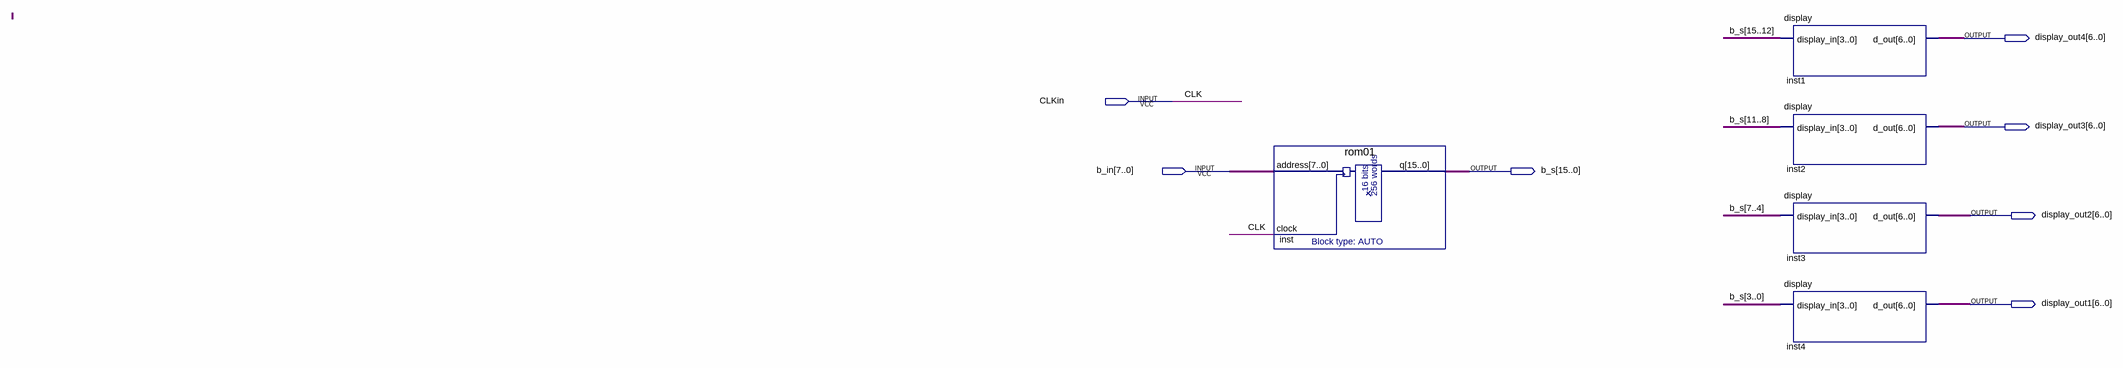
[diagram p0: schematic sheet]
// Quartus schematic mem256x16.bdf as structural Verilog: 5 symbols, 7 pins
module mem256x16 (
  input  CLKin,
  input  [7:0] b_in,
  output [6:0] display_out4,
  output [6:0] display_out3,
  output [15:0] b_s,
  output [6:0] display_out2,
  output [6:0] display_out1
);

  rom01 inst (.address(b_in), .clock(CLKin), .q(b_s));
  display inst1 (.display_in(b_s[15:12]), .d_out(display_out4));
  display inst2 (.display_in(b_s[11:8]), .d_out(display_out3));
  display inst3 (.display_in(b_s[7:4]), .d_out(display_out2));
  display inst4 (.display_in(b_s[3:0]), .d_out(display_out1));

  // Other names for the same wires on the sheet: CLK = CLKin
endmodule
